# EAGLE schematic ventiladores (EAGLE 6.1)
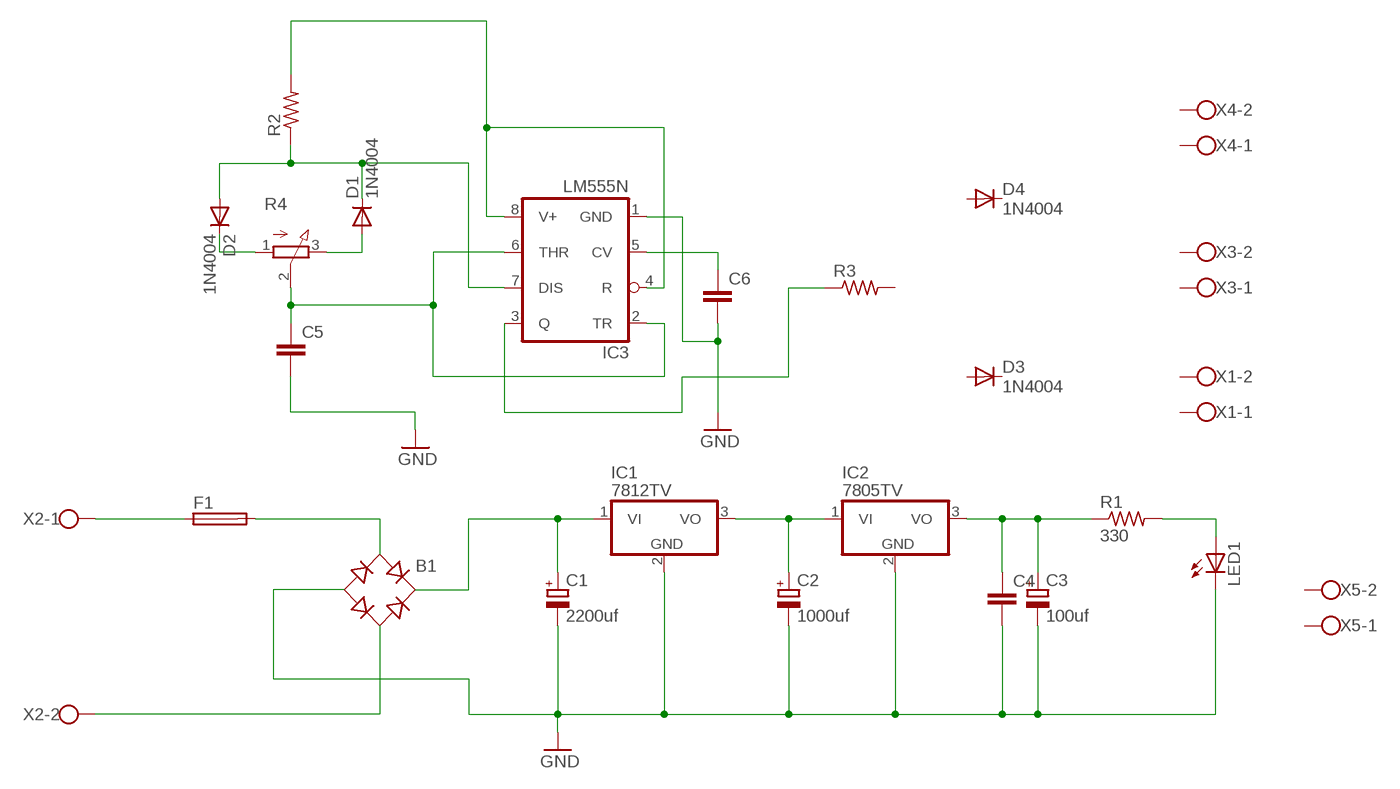
[diagram p0: schematic, sheet 1]

## Parts
B1  RB1A  [RB1A]
C1  2200uf  CPOL-EUE5-13  [E5-13]
C2  1000uf  CPOL-EUE5-10.5  [E5-10,5]
C3  100uf  CPOL-EUE2.5-6  [E2,5-6]
C4  C2.5/2  [C2.5-2]
C5  C2.5/2  [C2.5-2]
C6  C2.5/2  [C2.5-2]
D1  1N4004  [DO41-10]
D2  1N4004  [DO41-10]
D3  1N4004  [DO41-10]
D4  1N4004  [DO41-10]
F1  GSH15  [GSH15]
IC1  7812TV  [TO220V]
IC2  7805TV  [TO220V]
IC3  LM555N  [DIL08]
LED1  LED5MM  [LED5MM]
R1  330  R-US_0204/5  [0204/5]
R2  R-US_0207/7  [0207/7]
R3  R-US_0207/7  [0207/7]
R4  3RP/1610N  [3RP/1610N]
X1  W237-102  [W237-102]
X2  W237-102  [W237-102]
X3  W237-102  [W237-102]
X4  W237-102  [W237-102]
X5  W237-102  [W237-102]

## Nets
GND: B1.- C1.- C2.- C3.- C4.2 C5.2 C6.2 IC1.2(GND) IC2.2(GND) IC3.1(GND) LED1.K(C)
N$1: F1.1 X2.1
N$2: B1.AC1 F1.2
N$3: B1.AC2 X2.2
N$4: B1.+ C1.+ IC1.1(VI)
N$6: C2.+ IC1.3(VO) IC2.1(VI)
N$7: C3.+ C4.1 IC2.3(VO) R1.1
N$8: LED1.A R1.2
N$9: D2.C R4.1(A)
N$10: D1.A R4.3(E)
N$11: D1.C D2.A IC3.7(DIS) R2.1
N$12: C5.1 IC3.2(TR) IC3.6(THR) R4.2(S)
N$14: IC3.3(Q) R3.1
N$15: IC3.4(R) IC3.8(V+) R2.2
N$17: C6.1 IC3.5(CV)
Unconnected: D3.A D3.C D4.A D4.C R3.2 X1.1 X1.2 X3.1 X3.2 X4.1 X4.2 X5.1 X5.2

## Library data of the parts
B1 = rectifier:RB1A: RECTIFIER 1 A
C1-C3 = rcl:CPOL-EU: POLARIZED CAPACITOR, European symbol
C4-C6 = capacitor-wima:C: CAPACITOR naming: grid - package width
D1-D4 = -redpic-diode-transistor:1N4004: DIODE general purpose rectifier, 1 A
F1 = fuse:GSH15: FUSE HOLDER grid 15mm, 19649 Wickmann; MPN: 64900001039; OC_FARNELL: 1271673; OC_NEWARK: 02P0318
IC1 IC2 = linear:78*: Positive VOLTAGE REGULATOR Source: http://cache.national.com/ds/LM/LM78L05.pdf http://www.fairchildsemi.com/ds/LM/LM7805.pdf
IC3 = linear:*555: TIMER
LED1 = led:LED: LED OSRAM: - CHIPLED LG R971, LG N971, LY N971, LG Q971, LY Q971, LO R971, LY R971 LH N974, LH R974 LS Q976, LO Q976, LY Q976 LO Q996 - Hyper CHIPLED LW Q18S LB Q993, LB Q99A, LB R99A - SideLED LS A670, LO A670, LY A670, LG A670, LP A670 LB A673, LV A673, LT A673, LW A673 LH A674 LY A675 LS A676, LA A676, LO A676, LY A676, LW A676 LS A679, LY A679, LG A679 - Hyper Micro SIDELED® LS Y876, LA Y876, LO Y876, LY Y876 LT Y87S - SmartLED LW L88C, LW L88S LB L89C, LB L89S, LG L890 LS L89K, LO L89K, LY L89K LS L896, LA L896, LO L896, LY L896 - TOPLED LS T670, LO T670, LY T670, LG T670, LP T670 LSG T670, LSP T670, LSY T670, LOP T670, LYG T670 LG T671, LOG T671, LSG T671 LB T673, LV T673, LT T673, LW T673 LH T674 LS T676, LA T676, LO T676, LY T676, LB T676, LH T676, LSB T676, LW T676 LB T67C, LV T67C, LT T67C, LS T67K, LO T67K, LY T67K, LW E67C LS E67B, LA E67B, LO E67B, LY E67B, LB E67C, LV E67C, LT E67C LW T67C LS T679, LY T679, LG T679 LS T770, LO T770, LY T770, LG T770, LP T770 LB T773, LV T773, LT T773, LW T773 LH T774 LS E675, LA E675, LY E675, LS T675 LS T776, LA T776, LO T776, LY T776, LB T776 LHGB T686 LT T68C, LB T68C - Hyper Mini TOPLED® LB M676 - Mini TOPLED Santana® LG M470 LS M47K, LO M47K, LY M47K Source: http://www.osram.convergy.de LUXEON: - LUMILED® LXK2-PW12-R00, LXK2-PW12-S00, LXK2-PW14-U00, LXK2-PW14-V00 LXK2-PM12-R00, LXK2-PM12-S00, LXK2-PM14-U00 LXK2-PE12-Q00, LXK2-PE12-R00, LXK2-PE12-S00, LXK2-PE14-T00, LXK2-PE14-U00 LXK2-PB12-K00, LXK2-PB12-L00, LXK2-PB12-M00, LXK2-PB14-N00, LXK2-PB14-P00, LXK2-PB14-Q00 LXK2-PR12-L00, LXK2-PR12-M00, LXK2-PR14-Q00, LXK2-PR14-R00 LXK2-PD12-Q00, LXK2-PD12-R00, LXK2-PD12-S00 LXK2-PH12-R00, LXK2-PH12-S00 LXK2-PL12-P00, LXK2-PL12-Q00, LXK2-PL12-R00 Source: www.luxeon.com KINGBRIGHT: KA-3528ASYC Source: www.kingbright.com
R1 = rcl:R-US_: RESISTOR, American symbol
R2 R3 = resistor:R-US_: RESISTOR, American symbol
R4 = pot:3RP/1610N: 16mm Potentiometer one level Source: http://www.alphapotentiometers.net/html/16mm_pot_2.html
X1-X5 = con-wago-500:W237-102: WAGO SCREW CLAMP; MPN: 237-102; OC_FARNELL: unknown; OC_NEWARK: 70K9898